# Altium schematic sheet Sch_NB-IoT.SchDoc
size A; SheetNumber: 1; SheetTotal: 1
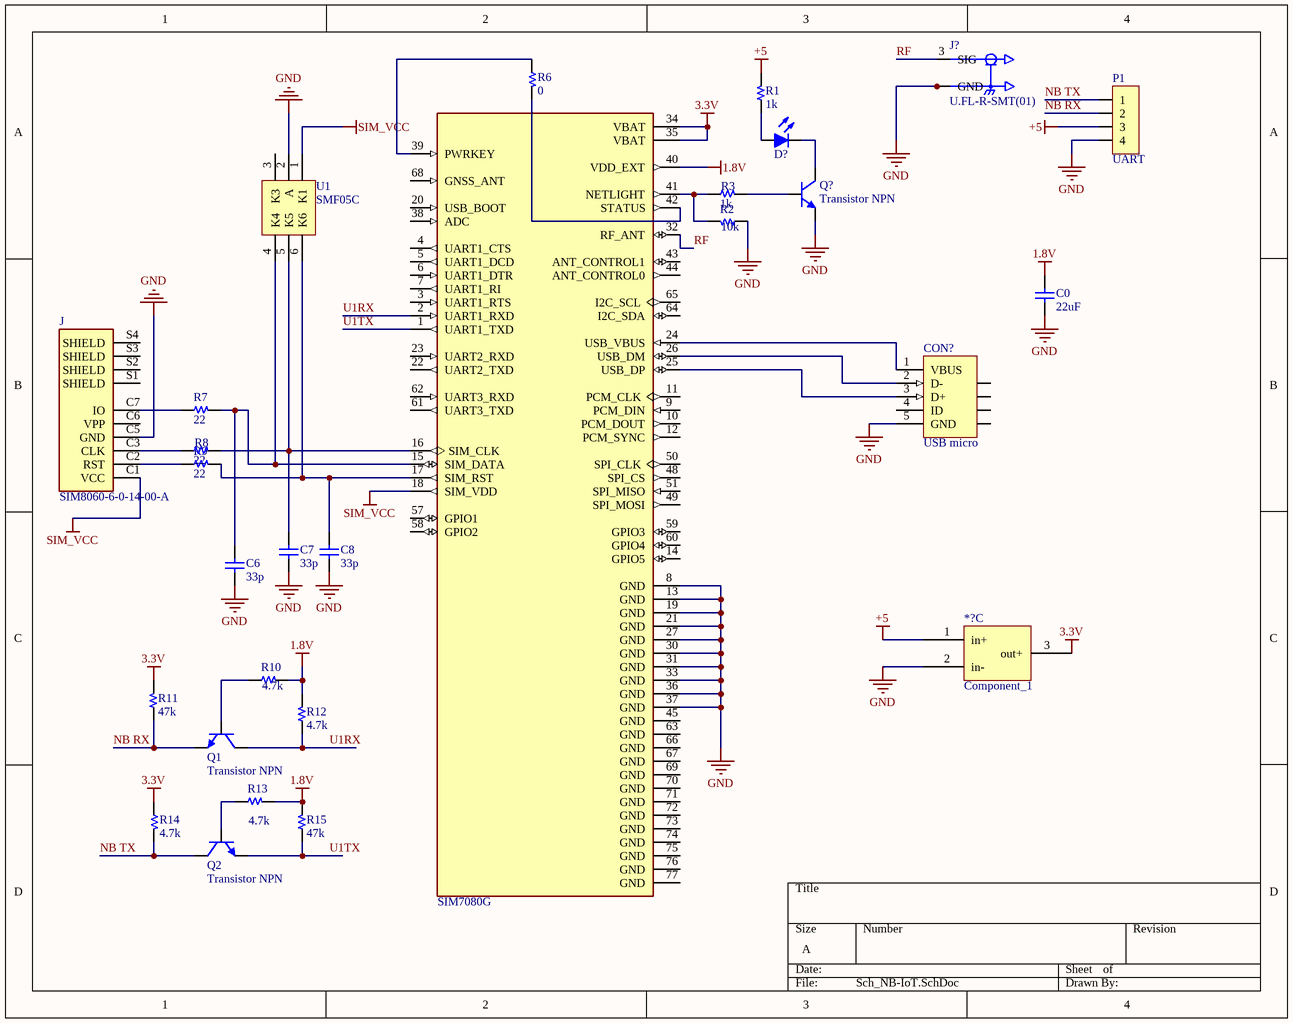
[diagram p0: Sch_NB-IoT.SchDoc]

## Parts
*?  Component_1  [PCBComponent_1]  (part C of 3)
?  SIM7080G  [XCVR_SIM7080G]
C0  22uF  [C 0805]
C6  33p  [C 0805]
C7  33p  [C 0805]
C8  33p  [C 0805]
CON?  USB micro  [CONN/USB/MICRO/RA]
D?  Led  [Led 0603 - red]  (value not drawn)
J  SIM8060-6-0-14-00-A  [GCT_SIM8060-6-0-14-00-A]
J?  U.FL-R-SMT(01)  [HRS_U.FL-R-SMT(01)]
P1  UART  [HDR/Header/4/2mm/BOX/RA]
Q1  Transistor NPN  [SOT-23]
Q2  Transistor NPN  [SOT-23]
Q?  Transistor NPN  [SOT-23]
R1  1k  [R 0805]
R2  10k  [R 0805]
R3  1k  [R 0805]
R6  0  [R 0805]
R7  22  [R 0805]
R8  22  [R 0805]
R9  22  [R 0805]
R10  4.7k  [R 0805]
R11  47k  [R 0805]
R12  4.7k  [R 0805]
R13  4.7k  [R 0805]
R14  4.7k  [R 0805]
R15  47k  [R 0805]
U1  SMF05C  [SOT-363-6]

## Nets
1.8V: ?.40(VDD_EXT) C0.2 R10.2 R12.2 R13.2 R15.2
3.3V: *?.3(out+) ?.34(VBAT) ?.35(VBAT) R11.2 R14.1
+5: *?.1(in+) P1.3 R1.2
GND: *?.2(in-) ?.8(GND) ?.13(GND) ?.19(GND) ?.21(GND) ?.27(GND) ?.30(GND) ?.31(GND) ?.33(GND) ?.36(GND) ?.37(GND) C0.1 C6.2 C7.2 C8.2 CON?.5(GND) J.C5(GND) J?.1(GND) J?.2(GND) P1.4 Q?.2(E) R2.1 U1.2(A)
SIM_VCC: ?.18(SIM_VDD) J.C1(VCC) U1.1(K1)
NB RX: P1.2 Q1.2(E) R11.1
NB TX: P1.1 Q2.3(C) R14.2
RF: ?.32(RF_ANT) J?.3(SIG)
U1RX: ?.2(UART1_RXD) Q1.3(C) R12.1
U1TX: ?.1(UART1_TXD) Q2.2(E) R15.1
Net?_15: ?.15(SIM_DATA) C6.1 R7.2 U1.4(K4)
Net?_16: ?.16(SIM_CLK) C7.1 R8.2 U1.5(K5)
Net?_17: ?.17(SIM_RST) C8.1 R9.2 U1.6(K6)
Net?_24: ?.24(USB_VBUS) CON?.1(VBUS)
Net?_25: ?.25(USB_DP) CON?.3(D+)
Net?_26: ?.26(USB_DM) CON?.2(D-)
Net?_39: ?.39(PWRKEY) R6.1
Net?_41: ?.41(NETLIGHT) R2.2 R3.1
Net?_42: ?.42(STATUS) R6.2
NetD?_1: D?.1(A) R1.1
NetD?_2: D?.2(K) Q?.3(C)
NetJ_C2: J.C2(RST) R9.1
NetJ_C3: J.C3(CLK) R8.1
NetJ_C7: J.C7(IO) R7.1
NetQ1_1: Q1.1(B) R10.1
NetQ2_1: Q2.1(B) R13.1
NetQ?_1: Q?.1(B) R3.2

Not connected (* = marked no-connect by the designer): ? 3(UART1_RTS) 4(UART1_CTS) 5(UART1_DCD) 6(UART1_DTR) 7(UART1_RI) 9(PCM_DIN) 10(PCM_DOUT) 11(PCM_CLK) 12(PCM_SYNC) 14(GPIO5) 20(USB_BOOT) 22(UART2_TXD) 23(UART2_RXD) 38(ADC) 43(ANT_CONTROL1) 44(ANT_CONTROL0) 45(GND) 48(SPI_CS) 49(SPI_MOSI) 50(SPI_CLK) 51(SPI_MISO) 57(GPIO1) 58(GPIO2) 59(GPIO3) 60(GPIO4) 61(UART3_TXD) 62(UART3_RXD) 63(GND) 64(I2C_SDA) 65(I2C_SCL) 66(GND) 67(GND) 68(GNSS_ANT) 69(GND) 70(GND) 71(GND) 72(GND) 73(GND) 74(GND) 75(GND) 76(GND) 77(GND); CON? 4(ID) 6(SHLD) 7(SHLD) 8(SHLD) 9(SHLD); J C6(VPP) S1(SHIELD) S2(SHIELD) S3(SHIELD) S4(SHIELD); U1 3(K3)

## Library data of the parts
? = SIM7080G: Cellular, Navigation Galileo, GLONASS, GPS, GNSS, LTE Transceiver Module 1.559GHz ~ 1.576GHz, 1.575GHz ~ 1.576GHz, 1.574GHz ~ 1.606GHz, 1.598GHz ~ 1.563GHz Antenna Not Included Surface Mount; MF: SIMCom; SnapEDA_Link: https://www.snapeda.com/parts/SIM7080G/SIMCom/view-part/?ref=snap; Package: Package; Value: *; MP: SIM7080G; Check_prices: https://www.snapeda.com/parts/SIM7080G/SIMCom/view-part/?ref=eda
C0 C6-C8 = Capacitor NP: Capacitor non-pol
CON? = CON USB micro: USB micro, 5 pins
D? = Led: Typical LED
J = SIM8060-6-0-14-00-A: 6 Position Card Connector NANO SIM Surface Mount, Right Angle Gold; MF: Global Connector Technology; MP: SIM8060-6-0-14-00-A; Package: Package Analog Devices; Price: None; Availability: Unavailable; SnapEDA_Link: https://www.snapeda.com/parts/SIM8060-6-0-14-00-A/Global%20Connector%20Technology/view-part/3214904/?ref=snap; Value: *
J? = U.FL-R-SMT(01): U.FL (UMCC) Connector Receptacle, Male Pin 50Ohm Surface Mount Solder. RF Connectors / Coaxial Connectors; MF: Hirose; Check_prices: https://www.snapeda.com/parts/U.FL-R-SMT(01)/Hirose+Electric+Co+Ltd/view-part/?ref=eda; Value: *; Availability: In Stock; MP: U.FL-R-SMT(01); Price: None; Package: None; SnapEDA_Link: https://www.snapeda.com/parts/U.FL-R-SMT(01)/Hirose+Electric+Co+Ltd/view-part/?ref=snap; Purchase-URL: https://pricing.snapeda.com/search/part/U.FL-R-SMT(01)/?ref=eda
P1 = Header 4: Header, 4-Pin
Q1 Q2 Q? = Transistor NPN: NPN Bipolar Transistor
R1-R3 R6-R15 = Resistor
U1 = SMF05C: 5-Line Transient Voltage Suppressor Array